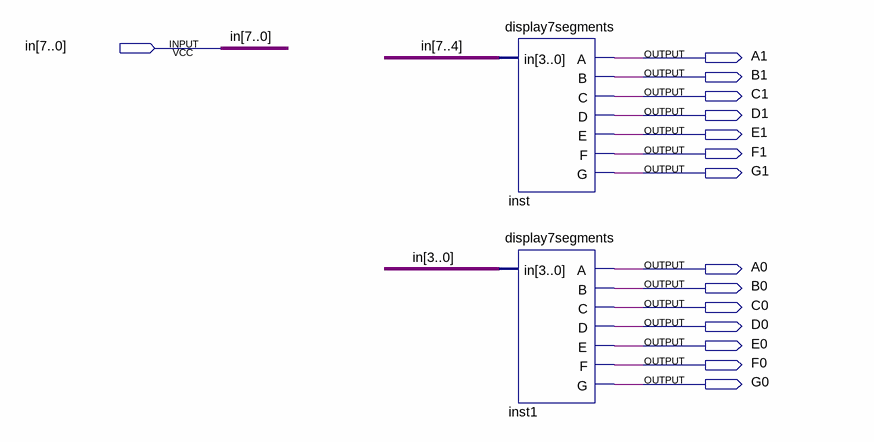
[diagram p0: schematic sheet]
// Quartus schematic dsp7sgms8b.bdf as structural Verilog: 2 symbols, 15 pins
module dsp7sgms8b (
  input  [7:0] in,
  output A1,
  output B1,
  output C1,
  output D1,
  output E1,
  output F1,
  output G1,
  output A0,
  output B0,
  output C0,
  output D0,
  output E0,
  output F0,
  output G0
);

  display7segments inst (.in(in[7:4]), .A(A1), .B(B1), .C(C1), .D(D1), .E(E1), .F(F1), .G(G1));
  display7segments inst1 (.in(in[3:0]), .A(A0), .B(B0), .C(C0), .D(D0), .E(E0), .F(F0), .G(G0));
endmodule
